# Altium schematic sheet tps54332_12v_to_7v.schdoc
size 331 x 127 mm; SheetNumber: 1; SheetTotal: 1
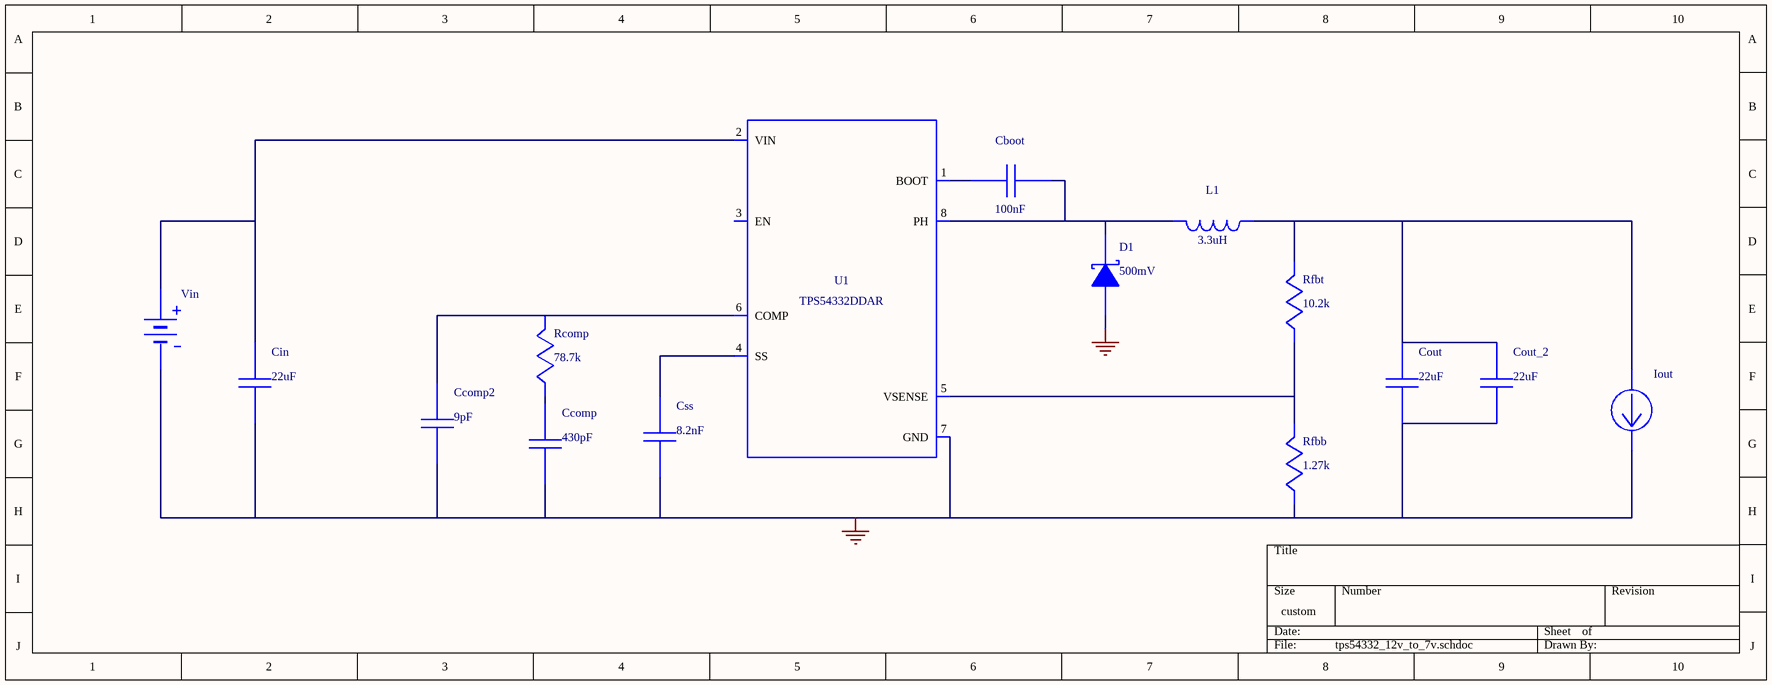
[diagram p0: tps54332_12v_to_7v.schdoc]

## Parts
Cboot  value 100nF  (hidden comment: C1005X5R1A104K)
Ccomp  value 430pF  (hidden comment: CL21C431JBANNNC)
Ccomp2  value 9pF  (hidden comment: CC0805DRNP09BN9R0)
Cin  value 22uF  (hidden comment: GRM32ER61E226KE15L)
Cout  value 22uF  (hidden comment: GRM32ER61C226KE20L)
Cout_2  value 22uF  (hidden comment: GRM32ER61C226KE20L)
Css  value 8.2nF  (hidden comment: GRM033R61A822KA01D)
D1  value 500mV  (hidden comment: B220-13-F)
Iout  WB_CURRENT_LOAD  (value not drawn)
L1  value 3.3uH  (hidden comment: XAL4030-332MEB)
Rcomp  value 78.7k  (hidden comment: CRCW040278K7FKED)
Rfbb  value 1.27k  (hidden comment: CRCW04021K27FKED)
Rfbt  value 10.2k  (hidden comment: CRCW040210K2FKED)
U1  TPS54332DDAR
Vin  WB_BATTERY  (value not drawn)

## Nets
0: Ccomp.2 Ccomp2.2 Cin.2 Cout.2 Cout_2.2 Css.2 D1.2(A) Iout.2(-) Rfbb.2 U1.7(GND) U1.9(ETPAD) Vin.2(-)
NetCboot_1: Cboot.1 U1.1(BOOT)
NetCboot_2: Cboot.2 D1.1(K) L1.1 U1.8(PH)
NetCcomp2_1: Ccomp2.1 Rcomp.1 U1.6(COMP)
NetCcomp_1: Ccomp.1 Rcomp.2
NetCin_1: Cin.1 U1.2(VIN) Vin.1(+)
NetCout_1: Cout.1 Cout_2.1 Iout.1(+) L1.2 Rfbt.1
NetCss_1: Css.1 U1.4(SS)
NetRfbb_1: Rfbb.1 Rfbt.2 U1.5(VSENSE)

Not connected (* = marked no-connect by the designer): U1 3(EN)

## Library data of the parts
Cboot = C1005X5R1A104K: Manufacturer Name: TDK; PackageReference: C1005X5R1A104K; Manufacturer Part Number: C1005X5R1A104K
Ccomp = CL21C431JBANNNC: Manufacturer Name: Samsung Electro-Mechanics; PackageReference: CL21C431JBANNNC; Manufacturer Part Number: CL21C431JBANNNC
Ccomp2 = CC0805DRNP09BN9R0: CC0805DRNP09BN9R; Manufacturer Name: Yageo America; PackageReference: CC0805DRNP09BN9R0; Manufacturer Part Number: CC0805DRNP09BN9R0
Cin = GRM32ER61E226KE15L: GRM32ER61E226KE1; Manufacturer Name: MuRata; PackageReference: GRM32ER61E226KE15L; Manufacturer Part Number: GRM32ER61E226KE15L
Cout Cout_2 = GRM32ER61C226KE20L: GRM32ER61C226KE2; Manufacturer Name: MuRata; PackageReference: GRM32ER61C226KE20L; Manufacturer Part Number: GRM32ER61C226KE20L
Css = GRM033R61A822KA01D: GRM033R61A822KA0; Manufacturer Name: MuRata; PackageReference: GRM033R61A822KA01D; Manufacturer Part Number: GRM033R61A822KA01D
D1 = B220-13-F: Manufacturer Name: Diodes Inc.; PackageReference: B220-13-F; Manufacturer Part Number: B220-13-F
Iout = WB_CURRENT_LOAD: Value: UNLISTED; PackageReference: WB_CURRENT_LOAD; Manufacturer Part Number: WB_CURRENT_LOAD; Manufacturer Name: WB_CURRENT_LOAD
L1 = XAL4030-332MEB: Manufacturer Name: Coilcraft; PackageReference: XAL4030-332MEB; Manufacturer Part Number: XAL4030-332MEB
Rcomp = CRCW040278K7FKED: Manufacturer Name: Vishay-Dale; PackageReference: CRCW040278K7FKED; Manufacturer Part Number: CRCW040278K7FKED
Rfbb = CRCW04021K27FKED: Manufacturer Name: Vishay-Dale; PackageReference: CRCW04021K27FKED; Manufacturer Part Number: CRCW04021K27FKED
Rfbt = CRCW040210K2FKED: Manufacturer Name: Vishay-Dale; PackageReference: CRCW040210K2FKED; Manufacturer Part Number: CRCW040210K2FKED
U1 = TPS54332DDAR: Manufacturer Name: Texas Instruments; Value: UNLISTED; PackageReference: TPS54332DDAR; Manufacturer Part Number: TPS54332DDAR
Vin = WB_BATTERY: Value: UNLISTED; PackageReference: WB_BATTERY; Manufacturer Part Number: WB_BATTERY; Manufacturer Name: WB_BATTERY